# Altium schematic sheet Keypad.SchDoc
size A; Organization: Altium Limited; Address1: L3, 12a Rodborough Rd; Address2: Frenchs Forest; Address3: NSW; Address4: Australia 2086; DocumentNumber: 3; SheetNumber: 3; SheetTotal: 3
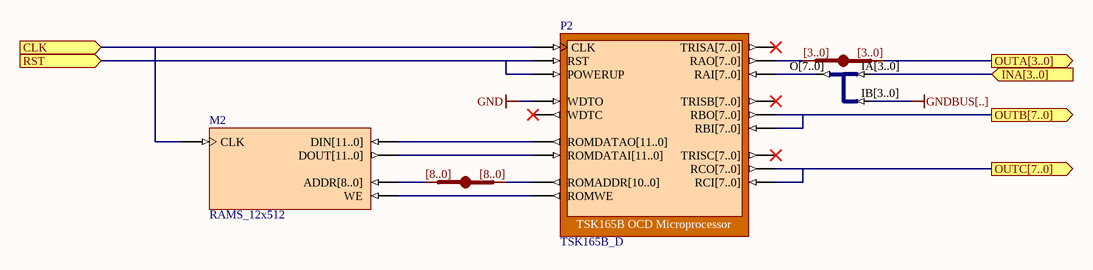
[diagram p0: Keypad.SchDoc]

## Parts
M2  RAMS_12x512
P2  TSK165B_D
U3  IndexA: [3..0]  (hidden comment: JB)
U4  J4B2_8B  (value not drawn)
U5  IndexA: [8..0]  (hidden comment: JB)

## Ports
CLK (in), INA[3..0] (in), OUTA[3..0] (out), OUTB[7..0] (out), OUTC[7..0] (out), RST (in)

## Nets
GND: P2.WDTO
GNDBUS[..]: U4.IB[3..0]
CLK: M2.CLK P2.CLK ; port CLK
INA[3..0]: U4.IA[3..0] ; port INA[3..0]
OUTA[3..0]: U3.B[0..0] ; port OUTA[3..0]
OUTB[7..0]: P2.RBI[7..0] P2.RBO[7..0] ; port OUTB[7..0]
OUTC[7..0]: P2.RCI[7..0] P2.RCO[7..0] ; port OUTC[7..0]
RST: P2.POWERUP P2.RST ; port RST
NetM2_ADDR[8..0]: M2.ADDR[8..0] U5.B[0..0]
NetM2_DIN[11..0]: M2.DIN[11..0] P2.ROMDATAO[11..0]
NetM2_DOUT[11..0]: M2.DOUT[11..0] P2.ROMDATAI[11..0]
NetM2_WE: M2.WE P2.ROMWE
NetP2_RAI[7..0]: P2.RAI[7..0] U4.O[7..0]
NetP2_RAO[7..0]: P2.RAO[7..0] U3.A[0..0]
NetP2_ROMADDR[10..0]: P2.ROMADDR[10..0] U5.A[0..0]

Not connected (* = marked no-connect by the designer): P2 TRISA[7..0]* TRISB[7..0]* TRISC[7..0]* WDTC*

## Notes on the sheet
- Title
- Size:
- Date:
- A
- Number:
- Time:
- Revision:
- Sheet
- of
- File:

## Library data of the parts
M2 = RAMS_12x512: Single Port Random Access Memory; Memory_Depth: 512; Memory_Type: RAM_SinglePortBlock; Memory_Width: 12; Memory_ClockEdge: Rising; Nexus_Core: Memory_Program; Published: 13/01/2004; Publisher: Altium Hobart Technology Center
P2 = TSK165B_D: TSK165B OCD Microprocessor; NEXUS_CORE: Processor_OCDS; NEXUS_JTAG_DEVICE: True; NEXUS_JTAG_ORDER: 0; ChildModel1: TSK165B_D_RAM128x8; ChildCore1: M2; Published: 1/12/2003; Publisher: Altium Hobart Technology Centre; Core Revision: 1.00.00
U3 U5 = JB: System BUS Joiner; ArchiveName: GENERIC; Published: 18-Dec-2003; Publisher: Altium Limited; Core Revision: 1.00.00
  U3: IndexB: [3..0]
  U5: IndexB: [8..0]
U4 = J4B2_8B: 2 x 4-Bit input bus to 1 x 8-bit output bus; ArchiveName: GENERIC; Published: 18-Dec-2003; Publisher: Altium Limited; Core Revision: 1.00.00